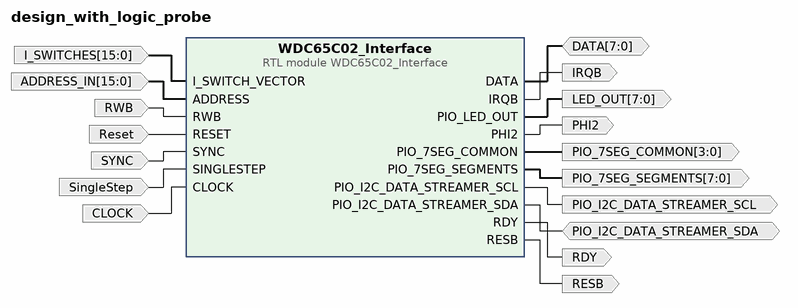
[diagram p0: block diagram of the top level]
# Vivado block design design_with_logic_probe, xc7a35tcpg236-1, Vivado 2025.2
create_bd_design design_with_logic_probe

create_bd_port -dir I Reset
create_bd_port -dir I -from 15 -to 0 ADDRESS_IN
create_bd_port -dir O -from 7 -to 0 LED_OUT
create_bd_port -dir I RWB
create_bd_port -dir I -type clk CLOCK
set_property -dict {CONFIG.FREQ_HZ 100000000} [get_bd_ports CLOCK]
create_bd_port -dir IO -from 7 -to 0 DATA
create_bd_port -dir O RDY
create_bd_port -dir O RESB
create_bd_port -dir I SingleStep
create_bd_port -dir O PHI2
create_bd_port -dir I SYNC
create_bd_port -dir O IRQB
create_bd_port -dir O -from 3 -to 0 PIO_7SEG_COMMON
create_bd_port -dir O -from 7 -to 0 PIO_7SEG_SEGMENTS
create_bd_port -dir IO PIO_I2C_DATA_STREAMER_SDA
create_bd_port -dir O -type clk PIO_I2C_DATA_STREAMER_SCL
create_bd_port -dir I -from 15 -to 0 I_SWITCHES

create_bd_cell -type module -reference WDC65C02_Interface WDC65C02_Interface

# ---- connections ----

connect_bd_net [get_bd_ports I_SWITCHES] [get_bd_pins WDC65C02_Interface/I_SWITCH_VECTOR]
connect_bd_net [get_bd_ports ADDRESS_IN] [get_bd_pins WDC65C02_Interface/ADDRESS]
connect_bd_net [get_bd_ports DATA] [get_bd_pins WDC65C02_Interface/DATA]
connect_bd_net [get_bd_ports PIO_I2C_DATA_STREAMER_SDA] [get_bd_pins WDC65C02_Interface/PIO_I2C_DATA_STREAMER_SDA]
connect_bd_net -net RWB_PIN_1 [get_bd_ports RWB] [get_bd_pins WDC65C02_Interface/RWB]
connect_bd_net [get_bd_ports Reset] [get_bd_pins WDC65C02_Interface/RESET]
connect_bd_net [get_bd_ports SYNC] [get_bd_pins WDC65C02_Interface/SYNC]
connect_bd_net [get_bd_ports SingleStep] [get_bd_pins WDC65C02_Interface/SINGLESTEP]
connect_bd_net -net WD6502_Interface_0_PHI2 [get_bd_pins WDC65C02_Interface/PHI2] [get_bd_ports PHI2]
connect_bd_net -net WD6502_Interface_0_PIO_LED_OUT [get_bd_pins WDC65C02_Interface/PIO_LED_OUT] [get_bd_ports LED_OUT]
connect_bd_net -net WDC65C02_Interface_0_IRQB [get_bd_pins WDC65C02_Interface/IRQB] [get_bd_ports IRQB]
connect_bd_net -net WDC65C02_Interface_0_PIO_7SEG_COMMON [get_bd_pins WDC65C02_Interface/PIO_7SEG_COMMON] [get_bd_ports PIO_7SEG_COMMON]
connect_bd_net -net WDC65C02_Interface_0_PIO_7SEG_SEGMENTS [get_bd_pins WDC65C02_Interface/PIO_7SEG_SEGMENTS] [get_bd_ports PIO_7SEG_SEGMENTS]
connect_bd_net -net WDC65C02_Interface_0_RDY [get_bd_pins WDC65C02_Interface/RDY] [get_bd_ports RDY]
connect_bd_net -net WDC65C02_Interface_0_RESB [get_bd_pins WDC65C02_Interface/RESB] [get_bd_ports RESB]
connect_bd_net [get_bd_pins WDC65C02_Interface/PIO_I2C_DATA_STREAMER_SCL] [get_bd_ports PIO_I2C_DATA_STREAMER_SCL]
connect_bd_net -net clk_wiz_0_clk_out1 [get_bd_ports CLOCK] [get_bd_pins WDC65C02_Interface/CLOCK]

validate_bd_design
save_bd_design
